# EAGLE design progtypec2 (EAGLE 9.0.1)

## Sheet 1 of 2
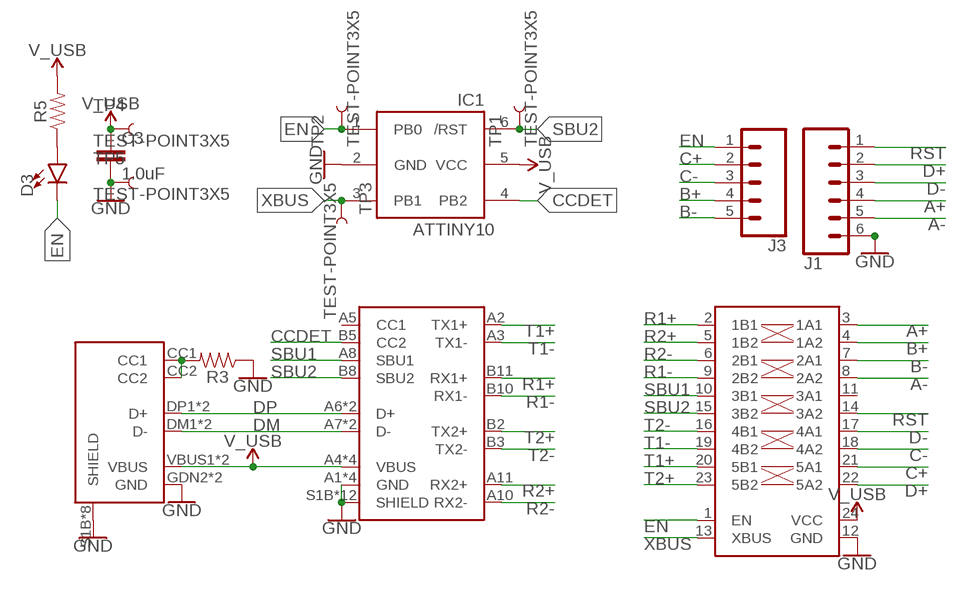
[diagram p0: schematic, sheet 1]

### Parts
C3  1.0uF  1.0UF-0603-16V-10%  [0603]
D3  LED0603  [LED-0603]
IC1  ATTINY10  [SOT23-6]
J1  CONN_06NO_SILK_FEMALE_PTH  [1X06_NO_SILK]
J3  CONN_05NO_SILK  [1X05_NO_SILK]
R3  RESISTOR0603  [0603]
R5  RESISTOR0603  [0603]
TP1  TEST-POINT3X5  [PAD.03X.05]
TP2  TEST-POINT3X5  [PAD.03X.05]
TP3  TEST-POINT3X5  [PAD.03X.05]
TP4  TEST-POINT3X5  [PAD.03X.05]
TP5  TEST-POINT3X5  [PAD.03X.05]
U$1  USB-C-HORZ-F  [USB-C_24PIN_HORZ-F-UNTESTED]
U$2  USB-C_USB2ONLY-HORZ-F_12P  [USB-C_12PIN_HORZ-F]
U$3  SN74CBT3383C  [TSSOP24]

### Nets
A+: J1.4 U$3.3(1A1)
A-: J1.5 U$3.8(2A2)
B+: J3.4 U$3.4(1A2)
B-: J3.5 U$3.7(2A1)
C+: J3.2 U$3.21(5A1)
C-: J3.3 U$3.18(4A2)
CCDET: IC1.4(PB2) U$1.B5(CC2)
CCUP: R3.2 U$2.CC1 U$2.CC2
D+: J1.2 U$3.22(5A2)
D-: J1.3 U$3.17(4A1)
DM: U$1.A7(D-) U$1.B7(D-) U$2.DM1(D-) U$2.DM2(D-)
DP: U$1.A6(D+) U$1.B6(D+) U$2.DP1(D+) U$2.DP2(D+)
EN: D3.C IC1.1(PB0) J3.1 TP2.P$1 U$3.1(EN)
GND: C3.2 IC1.2(GND) J1.6 R3.1 TP5.P$1 U$1.A1(GND) U$1.A12(GND) U$1.B1(GND) U$1.B12(GND) U$1.S1B(SHIELD) U$1.S1T(SHIELD) U$1.S2B(SHIELD) U$1.S2T(SHIELD) U$1.S3B(SHIELD) U$1.S3T(SHIELD) U$1.S4B(SHIELD) U$1.S4T(SHIELD) U$1.S5B(SHIELD) U$1.S5T(SHIELD) U$1.S6B(SHIELD) U$1.S6T(SHIELD) U$2.GDN2(GND) U$2.GND1(GND) U$2.S1B(SHIELD) U$2.S1T(SHIELD) U$2.S2B(SHIELD) U$2.S2T(SHIELD) U$2.S3B(SHIELD) U$2.S3T(SHIELD) U$2.S4B(SHIELD) U$2.S4T(SHIELD) U$3.12(GND)
N$1: D3.A R5.1
R1+: U$1.B11(RX1+) U$3.2(1B1)
R1-: U$1.B10(RX1-) U$3.9(2B2)
R2+: U$1.A11(RX2+) U$3.5(1B2)
R2-: U$1.A10(RX2-) U$3.6(2B1)
RST: J1.1 U$3.14(3A2)
SBU1: U$1.A8(SBU1) U$3.10(3B1)
SBU2: IC1.6(/RST) TP1.P$1 U$1.B8(SBU2) U$3.15(3B2)
T1+: U$1.A2(TX1+) U$3.20(5B1)
T1-: U$1.A3(TX1-) U$3.19(4B2)
T2+: U$1.B2(TX2+) U$3.23(5B2)
T2-: U$1.B3(TX2-) U$3.16(4B1)
V_USB: C3.1 IC1.5(VCC) R5.2 TP4.P$1 U$1.A4(VBUS) U$1.A9(VBUS) U$1.B4(VBUS) U$1.B9(VBUS) U$2.VBUS1(VBUS) U$2.VBUS2(VBUS) U$3.24(VCC)
XBUS: IC1.3(PB1) TP3.P$1 U$3.13(XBUS)
Unconnected: U$1.A5(CC1) U$3.11(3A1)

## Sheet 2 of 2

## Library data of the parts
C3 = SparkFun-Capacitors:1.0UF: 1µF ceramic capacitors A capacitor is a passive two-terminal electrical component used to store electrical energy temporarily in an electric field.; PROD_ID: CAP-00868
D3 = SparkFun-LED:LED: LED (Generic) Standard schematic elements and footprints for 5mm, 3mm, 1206, and 0603 sized LEDs. Generic LEDs with no color specified.
IC1 = adafruitgithub:ATTINY10: ATtiny4/5/9/10 8-bit Microcontroller with 512/1024 Bytes In-System Programmable Flash
J1 = SparkFun-Connectors:CONN_06: Multi connection point. Often used as Generic Header-pin footprint for 0.1 inch spaced/style header connections On any of the 0.1 inch spaced packages, you can populate with these: Break Away Headers - Straight <https://www.sparkfun.com/products/116> (PRT-00116) Break Away Male Headers - Right Angle <https://www.sparkfun.com/products/553> (PRT-00553) Female Headers <https://www.sparkfun.com/products/115> (PRT-00115) Break Away Headers - Machine Pin <https://www.sparkfun.com/products/117> (PRT-00117) Break Away Female Headers - Swiss Machine Pin <https://www.sparkfun.com/products/743> (PRT-00743) Arduino Stackable Header - 6 Pin <https://www.sparkfun.com/products/9280> (PRT-09280) For SCREWTERMINALS and SPRING TERMINALS visit here: Screw Terimnals on SparkFun.com <https://www.sparkfun.com/search/results?term=Screw+Terminals> (5mm/3.5mm/2.54mm spacing) This device is also useful as a general connection point to wire up your design to another part of your project. Our various solder wires solder well into these plated through hole pads. Hook-Up Wire - Assortment (Stranded, 22 AWG) <https://www.sparkfun.com/products/11375> (PRT-11375) Hook-Up Wire - Assortment (Solid Core, 22 AWG) <https://www.sparkfun.com/products/11367> (PRT-11367) View the entire wire category on our website here <https://www.sparkfun.com/categories/141>; PROD_ID: CONN-08437
J3 = SparkFun-Connectors:CONN_05: Multi connection point. Often used as Generic Header-pin footprint for 0.1 inch spaced/style header connections On any of the 0.1 inch spaced packages, you can populate with these: Break Away Headers - Straight <https://www.sparkfun.com/products/116> (PRT-00116) Break Away Male Headers - Right Angle <https://www.sparkfun.com/products/553> (PRT-00553) Female Headers <https://www.sparkfun.com/products/115> (PRT-00115) Break Away Headers - Machine Pin <https://www.sparkfun.com/products/117> (PRT-00117) Break Away Female Headers - Swiss Machine Pin <https://www.sparkfun.com/products/743> (PRT-00743) For SCREWTERMINALS and SPRING TERMINALS visit here: Screw Terimnals on SparkFun.com <https://www.sparkfun.com/search/results?term=Screw+Terminals> (5mm/3.5mm/2.54mm spacing) This device is also useful as a general connection point to wire up your design to another part of your project. Our various solder wires solder well into these plated through hole pads. Hook-Up Wire - Assortment (Stranded, 22 AWG) <https://www.sparkfun.com/products/11375> (PRT-11375) Hook-Up Wire - Assortment (Solid Core, 22 AWG) <https://www.sparkfun.com/products/11367> (PRT-11367) View the entire wire category on our website here <https://www.sparkfun.com/categories/141> Special notes: Molex polarized connector foot print use with SKU : PRT-08231 with associated crimp pins and housings. 1MM SMD Version SKU: PRT-10208
R3 R5 = SparkFun-Resistors:RESISTOR: Generic Resistor Package
TP1-TP5 = SparkFun-Connectors:TEST-POINT: SparkFun Test Points Bare copper test points for troubleshooting or In-Circuit-Testing. These are used by our Production team for verifying production board runs using pogo-pins on test beds. SparkFun Products: SparkFun LSM9DS1 Breakout <https://www.sparkfun.com/products/13284> SparkFun PSOC <https://www.sparkfun.com/products/13714> SparkFun Load Cell Amplifier <https://www.sparkfun.com/products/13879>
U$1 = 12voltman:USB-C
U$2 = 12voltman:USB-C_USB2ONLY
U$3 = 12voltman:SN74CBT3383C

## Board
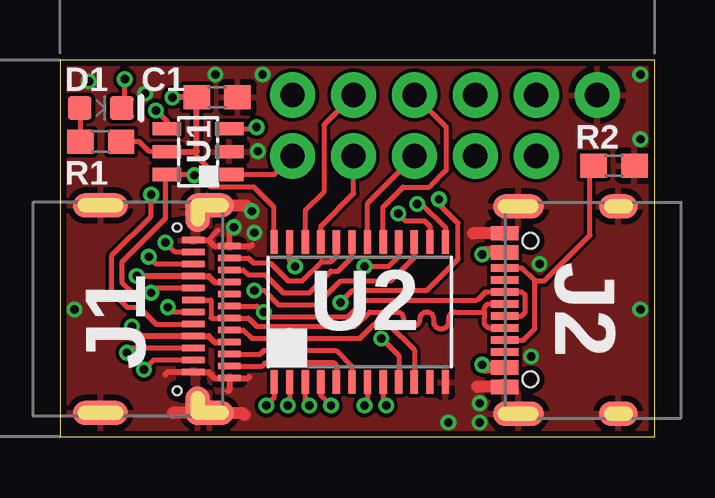
[diagram p1: board, top side]
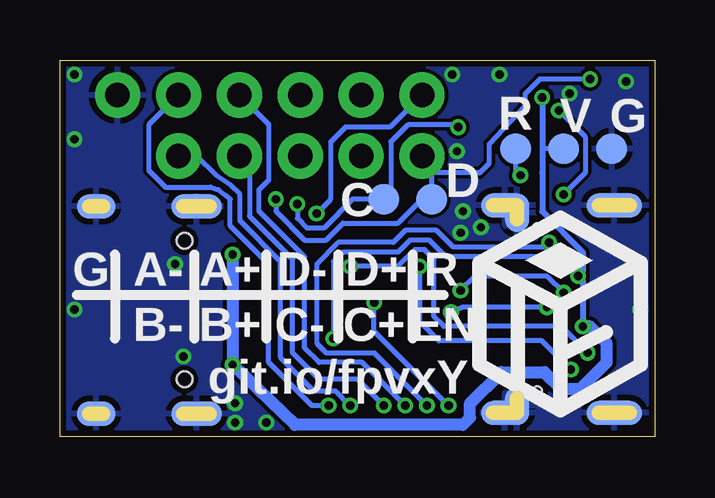
[diagram p2: board, bottom side, seen from below]

Size 24.8 x 15.7 mm. Coordinates in mm from the lower left corner, seen from the top.
Outline: 0,0 24.8,0 24.8,15.7 0,15.7 0,0
Copper layers (1*16): Top 0.035mm / dielectric 1.5mm / Bottom 0.035mm
Design rules "SeeedStudio_2layer_DRU": minimum track width 6mil, minimum drill 12mil, track to track 6mil, track to pad 6mil, pad to pad 6mil, via to via 6mil, smd to smd 0mil, copper to edge 10mil, drill to drill 10mil, minimum pad ring 10mil, minimum via ring 6mil, stop-mask expansion 2mil, vias tented up to drill 100mil, thermal gap 10mil

### Footprints (pad centres in the part's own frame; a part is rotated, then mirrored left to right if it is on the bottom)
0603 = smd 1.1 x 1: 1 -0.85,0; 2 0.85,0
LED-0603 = smd 1 x 1: A -0.877,0; C 0.877,0
SOT23-6 = smd 0.55 x 1.2: 1 -0.95,-1.3; 2 0,-1.3; 3 0.95,-1.3; 4 0.95,1.3; 5 0,1.3; 6 -0.95,1.3
1X06_NO_SILK = drill 1.016 pad 1.88: 1 0,0; 2 2.54,0; 3 5.08,0; 4 7.62,0; 5 10.16,0; 6 12.7,0
1X05_NO_SILK = drill 1.016 pad 1.88: 1 0,0; 2 2.54,0; 3 5.08,0; 4 7.62,0; 5 10.16,0
PAD.03X.05 = smd 1.27 x 1.27: P$1 0,0
USB-C_24PIN_HORZ-F-UNTESTED = smd 0.28 x 0.95: A1 2.625,-1.975; A2 2.125,-1.975; A3 1.625,-1.975; A4 1.125,-1.975; A5 0.625,-1.975; A6 0.125,-1.975; A7 -0.375,-1.975; A8 -0.875,-1.975; A9 -1.375,-1.975; A10 -1.875,-1.975; A11 -2.375,-1.975; A12 -2.875,-1.975; B1 -2.625,-0.475; B2 -2.125,-0.475; B3 -1.625,-0.475; B4 -1.125,-0.475; B5 -0.625,-0.475; B6 -0.125,-0.475; B7 0.375,-0.475; B8 0.875,-0.475; B9 1.375,-0.475; B10 1.875,-0.475; B11 2.375,-0.475; B12 2.875,-0.475 | smd 1 x 2.3 bottom: S1B -4.32,3.4; S6B 4.32,3.4 | smd 1 x 2.3: S1T -4.32,3.4; S6T 4.32,3.4 | smd 1.6 x 1 bottom: S2B -4.02,-0.65; S5B 4.02,-0.65 | smd 1.6 x 1: S2T -4.02,-0.65; S5T 4.02,-0.65 | smd 1 x 2 bottom: S3B -4.32,-1.15; S4B 4.32,-1.15 | smd 1 x 2: S3T -4.32,-1.15; S4T 4.32,-1.15 | hole 0.35: -3.4,0.2; 3.4,0.2
USB-C_12PIN_HORZ-F = smd 0.3 x 1.15: CC1 1.25,-0.575; CC2 -1.75,-0.575; DM1 -0.25,-0.575; DM2 0.75,-0.575; DP1 0.25,-0.575; DP2 -0.75,-0.575; SBU1 -1.25,-0.575; SBU2 1.75,-0.575 | smd 0.6 x 1.15: GDN2 3.2,-0.575; GND1 -3.2,-0.575; VBUS1 -2.4,-0.575; VBUS2 2.4,-0.575 | smd 1 x 2.1 bottom: S1B -4.32,0; S4B 4.32,0 | smd 1 x 2.1: S1T -4.32,0; S4T 4.32,0 | smd 1 x 1.6 bottom: S2B -4.32,4.18; S3B 4.32,4.18 | smd 1 x 1.6: S2T -4.32,4.18; S3T 4.32,4.18 | hole 0.65: -2.89,0.5; 2.89,0.5
TSSOP24 = smd 0.305 x 0.991: 1 -3.575,-2.918; 2 -2.925,-2.918; 3 -2.275,-2.918; 4 -1.625,-2.918; 5 -0.975,-2.918; 6 -0.325,-2.918; 7 0.325,-2.918; 8 0.975,-2.918; 9 1.625,-2.918; 10 2.275,-2.918; 11 2.925,-2.918; 12 3.575,-2.918; 13 3.575,2.918; 14 2.925,2.918; 15 2.275,2.918; 16 1.625,2.918; 17 0.975,2.918; 18 0.325,2.918; 19 -0.325,2.918; 20 -0.975,2.918; 21 -1.625,2.918; 22 -2.275,2.918; 23 -2.925,2.918; 24 -3.575,2.918

### Placement (x,y rotation side)
C3  6.55,14.14 0 top
D3  1.7,13.7 0 top
IC1  5.76,11.88 90 top
J1  9.7,14.24 0 top
J3  9.7,11.7 0 top
R3  23.1,11.3 180 top
R5  1.7,12.3 0 top
TP1  5.8,12 0 bottom
TP2  9.3,9.9 0 bottom
TP3  11.3,9.9 0 bottom
TP4  3.8,12 0 bottom
TP5  1.8,12 0 bottom
U$1  5.09,5.32 90 top
U$2  19.11,5.28 270 top
U$3  12.5,5.2 0 top

### Tracks (layer width: path | path; a pad name or v marks a point on that pad's centre or on a via)
A+  (via drill 0.35)
  Top 0.203: U$3.3 10.22,1.48 v10.4,1.3
  Bottom 0.203: v10.4,1.3 12.2,3.1 14,3.1 14.6,3.7 14.6,7.5 16.5,9.4 16.5,10.3 16.1,10.7 16.1,13 16.1,13.02 J1.4
A-  (via drill 0.35)
  Top 0.203: U$3.8 13.47,1.43 v13.6,1.3
  Bottom 0.203: v13.6,1.3 14.3,1.3 16.1,3.1 16.1,7.2 17.7,8.8 17.7,9.9 17.93,10.09 18.2,10.3 18.5,10.4 20.4,10.4 21.1,11.1 21.1,13 J1.5
B+  (via drill 0.35)
  Top 0.203: U$3.4 10.88,1.73 v11.3,1.3
  Bottom 0.203: v11.3,1.3 12.4,2.4 14,2.4 15.1,3.5 15.1,7.4 16.9,9.2 16.9,11.18 J3.4
B-  (via drill 0.35)
  Top 0.203: U$3.7 12.82,1.43 v12.7,1.3
  Bottom 0.203: v12.7,1.3 13.3,1.9 14.2,1.9 15.6,3.3 15.6,7.3 17.3,9 17.3,10.1 17.7,10.5 18.3,10.9 19.1,11.7 J3.5
C+
  Top 0.203: U$3.21 10.88,8.78 12.24,10.14 J3.2
C-
  Top 0.203: U$3.18 12.82,9.72 14.78,11.68 J3.3
CCDET  (via drill 0.35)
  Top 0.203: U$1.B5 4,4.7 3.3,5.4 2.8,5.4 2.16,6.04 2.16,7.56 3.8,9.2 v3.8,10.1 | v4,13.6 4.46,13.14 IC1.4
  Bottom 0.203: v4,13.6 2.9,12.5 2.9,11 v3.8,10.1
CCUP
  Top 0.203: U$2.CC1 19.33,4.03 19.8,4.5 19.8,6.5 | U$2.CC2 19.27,7.03 19.8,6.5 | 19.8,6.5 20.2,6.5 22.1,8.4 22.1,10.85 R3.2 22.2,10.95
D+
  Top 0.203: U$3.22 10.22,9.43 11,10.2 11,13 J1.2
D-
  Top 0.203: U$3.17 13.47,9.57 14.3,10.4 15.4,10.4 16.1,11.1 16.1,12.92 J1.3
DM
  Top 0.203: U$2.DM1 17.83,5.53 17.7,5.4 17.7,5.2 | U$1.B7 6.3,5.7 6.3,4.95 U$1.A7 7.86,4.95 8.2,4.6 12.3,4.6 12.9,5.2 14.04,5.2 arc-90 14.33,4.91 arc90 14.62,4.62 14.72,4.62 arc90 15.01,4.91 arc-90 15.3,5.2 15.29,5.2 arc-90 15.58,4.91 15.58,4.79 arc90 15.87,4.5 15.92,4.5 arc90 16.21,4.79 16.21,4.91 arc-90 16.5,5.2 17.7,5.2 | U$2.DM2 17.87,4.53 17.7,4.7 17.7,5 17.7,5.2
DP  (via drill 0.35)
  Top 0.203: U$2.DP1 19.23,5.03 19.4,5.2 19.4,5.9 19.27,6.03 U$2.DP2 | U$1.B6 4.71,5.2 v4.5,5.4 | 18.5,6 U$2.DP2 | 7.33,5.45 U$1.A6 8.2,5.45 v8.5,5.2 | v8.5,5.2 8.2,5.4 | v8.5,5.2 8.7,5 12,5 12.7,5.7 17.4,5.7 17.73,6.03 U$2.DP2
  Bottom 0.203: v4.5,5.4 8,5.4 v8.5,5.2
EN  (via drill 0.35)
  Top 0.203: IC1.1 8.93,10.93 J3.1 | 8.93,2.02 U$3.1 8.93,1.62 v8.6,1.3 | v11.7,5.6 12.2,6.1 15.3,6.1 16.6,7.4 16.6,8.9 15.8,9.7 v15.8,9.9 | D3.C 2.7,13.52 v2.7,14.9
  Bottom 0.203: 9.33,11 9.33,11.33 J3.1 | v8.6,1.3 11.7,4.4 v11.7,5.6 | v15.8,9.9 15.8,9.4 14.6,8.2 13.7,8.2 13,8.9 10.7,8.9 9.75,9.85 TP2.P$1 9.3,10.97 9.33,11 | 9.33,11 7.3,11 6.9,11.4 6.9,12.2 5.4,13.8 5.4,14.3 4.8,14.9 v2.7,14.9
GND  (via drill 0.35)
  Top 0.203: U$1.B12 6.2,8.2 6.6,8.6
  Top 0.254: U$1.B12 6.21,8.2 6.46,7.95 U$1.A1 | U$1.A12 6.46,2.44 6.21,2.69 U$1.B1 4.5,2.69 4.4,2.6 | U$1.A12 7.84,2.44 7.9,2.5 | U$1.A12 7.07,1.97 7,1.9 | U$1.A1 7.07,8.46 7.1,8.5 | U$1.A1 7.95,7.95 8,8
  Top 0.508: U$2.GND1 17.22,8.48 | U$2.GDN2 17.42,2.08 17.4,2.1 | U$1.S3B 7.6,1 7.7,0.9 | U$1.S2T 5.44,1 4.7,1 | U$1.S4T 7.76,9.64 v8,9.4
  other vias: 16.2,0.6 8.25,11.9 17.5,0.6 17.5,1.4 24.2,15.1 20,7.2 7.25,8.73 8.1,8.5 6.47,15.1 19.65,3.35 8.45,15.1 24.2,12.4 3.55,14.3 1.2,14.8 0.6,5.3 24.2,5.3
  pour Top: -1,19 32.3,19 32.3,-1 -1,-1
  pour Bottom: 32.3,19 -1,19 -1,-1 32.3,-1
N$1
  Top 0.203: D3.A 0.85,13.57 R5.1
R1+  (via drill 0.35)
  Top 0.203: U$1.B11 4.8,7.7 v4.4,8.1 | U$3.2 9.57,1.38 v9.5,1.3
  Bottom 0.203: v4.4,8.1 4.6,7.9 8.4,7.9 9.1,8.6 10.4,8.6 10.9,8.1 13.2,8.1 14.1,7.2 14.1,3.9 13.7,3.5 11.7,3.5 v9.5,1.3
R1-  (via drill 0.35)
  Top 0.203: U$1.B10 4,7.2 v3.7,7.5 | v13.4,4.1 14.12,3.38 U$3.9
  Bottom 0.203: v3.7,7.5 8.7,7.5 9.4,8.2 10.2,8.2 10.7,7.7 13,7.7 13.4,7.3 v13.4,4.1
R2+
  Top 0.203: U$1.A11 8.45,2.94 8.6,3.1 9,3.1 9.3,3.1 11.4,3.1 11.53,2.98 U$3.5
R2-
  Top 0.203: U$1.A10 8.35,3.44 8.5,3.6 11.5,3.6 12.18,2.92 U$3.6
RST  (via drill 0.35)
  Top 0.203: U$3.14 15.43,8.78 15.2,9 14.4,9 v14.1,9.3
  Bottom 0.203: v14.1,9.3 13.5,9.9 13.5,12.3 12.9,12.9 11.04,12.9 J1.1
SBU1
  Top 0.203: U$3.10 14.78,3.62 13.7,4.7 13.1,4.7 12.5,4.1 8,4.1 7.66,4.45 U$1.A8
SBU2  (via drill 0.35)
  Top 0.203: v5.6,10.9 5.67,10.93 IC1.6 4.4,10.93 4.4,9.1 2.6,7.3 2.6,6.4 3,6 v3.8,6 4,6.2 U$1.B8 | U$3.15 14.78,7.47 13.8,6.5 11.7,6.5 10.7,5.5 9.1,5.5 8.5,6.1 v8.1,6.1
  Bottom 0.203: v5.6,10.9 5.79,11.11 TP1.P$1 | v3.8,6 4.5,6.7 7.5,6.7 v8.1,6.1
T1+
  Top 0.203: U$3.20 11.53,7.53 11.3,7.3 10.9,7.3 10.1,6.5 9.5,6.5 8.76,7.25 8.05,7.25 7.86,7.45 U$1.A2
T1-
  Top 0.203: U$3.19 12.18,7.47 11.6,6.9 11.3,6.9 10.4,6 9.3,6 8.55,6.75 7.86,6.75 7.66,6.95 U$1.A3
T2+  (via drill 0.35)
  Top 0.203: U$1.B2 3.9,3.19 v3.5,2.8 | v9.8,7.1 9.57,7.33 U$3.23
  Bottom 0.203: v3.5,2.8 4.7,4 9,4 9.8,4.8 v9.8,7.1
T2-  (via drill 0.35)
  Top 0.203: U$1.B3 3,3.69 v2.8,3.5 | v12.7,7.1 13.7,7.1 14.12,7.53 U$3.16
  Bottom 0.203: v2.8,3.5 3.9,4.6 8.8,4.6 9.2,5 9.2,7.4 9.6,7.8 10,7.8 10.7,7.1 v12.7,7.1
V_USB  (via drill 0.35)
  Top 0.203: U$3.24 8.93,9.57 8.1,10.4 6.3,10.4 6.2,10.5 6.2,11.2 5.7,11.7 5.7,11.88 | 4.44,11.9 IC1.5 3.72,11.88 3.3,12.3 R5.2
  Top 0.254: U$1.A4 6.46,6.45 6.21,6.7 U$1.B9 3.9,6.7 v3.2,6.7 | U$1.A9 6.46,3.94 6.21,4.2 U$1.B4 3.4,4.2 v3,4.6 | IC1.5 5.7,11.88 C3.1 v4.69,14.14
  Top 0.508: U$2.VBUS2 17.72,2.88 v17.6,3 | U$2.VBUS1 17.68,7.68 v17.6,7.6
  Bottom 0.203: TP4.P$1 4.69,12 4.69,11
  Bottom 0.254: v3,4.6 3,6.5 v3.2,6.7 3,6.9 3,7.7 4.69,9.39 4.69,11 v4.69,14.14
  Bottom 0.508: v3,4.6 2.7,4.6 2,3.9 2,3.1 3.1,2 3.9,2 4.6,2.7 6.4,2.7 7.7,1.4 7.7,0.8 8,0.5 15,0.5 v17.6,3 v17.6,7.6
XBUS  (via drill 0.35)
  Top 0.203: IC1.3 8.13,12.83 v8.2,12.9 | U$3.13 16.07,8.72 15.1,9.7 v14.9,9.7
  Bottom 0.203: v8.2,12.9 8.3,13 10.3,13 11,12.3 11,9.92 TP3.P$1 | 11.1,10.18 TP3.P$1 | v14.9,9.7 14.9,9.1 14.5,8.7 13.8,8.7 12.6,9.9 TP3.P$1

### Text on the board
tPlace: D1 | C1 | U1 | R2 | R1 | U2 | J1 | J2
bPlace: R | G | V | D | C | R | D+ | D- | A+ | A- | G | EN | C+ | C- | B+ | B- | git.io/fpvxY